# EAGLE design MicroSDBreakout-V1 (EAGLE 6.1)
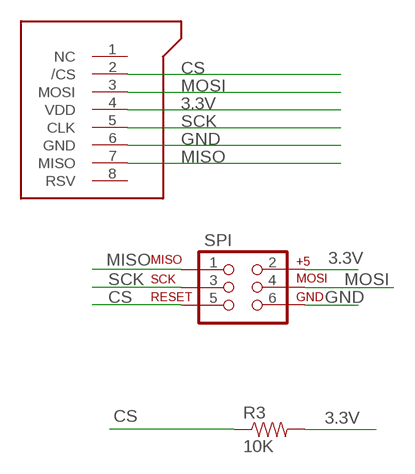
[diagram p0: schematic, sheet 1]

## Parts
R3  10K  RESISTOR0603-RES  [0603-RES]
SPI  AVR_SPI_PRG_6PTH  [2X3]
U$1  MICROSD  [MICRO-SD-SOCKET-PP]

## Nets
3.3V: R3.2 SPI.2 U$1.4(VDD)
CS: R3.1 SPI.5 U$1.2(/CS)
GND: SPI.6 U$1.6(GND)
MISO: SPI.1 U$1.7(MISO)
MOSI: SPI.4 U$1.3(MOSI)
SCK: SPI.3 U$1.5(CLK)
Unconnected: U$1.1(NC) U$1.8(RSV)

## Library data of the parts
R3 = SparkFun:RESISTOR: Resistor Basic schematic elements and footprints for 0603, 1206, and PTH resistors.
SPI = SparkFun:AVR_SPI_PRG_6: AVR ISP 6 Pin This is the reduced ISP connector for AVR programming. Common on Arduino. This footprint will take up less PCB space and can be used with a 10-pin to 6-pin adapter such as SKU: BOB-08508
U$1 = group10:MICROSD

## Board
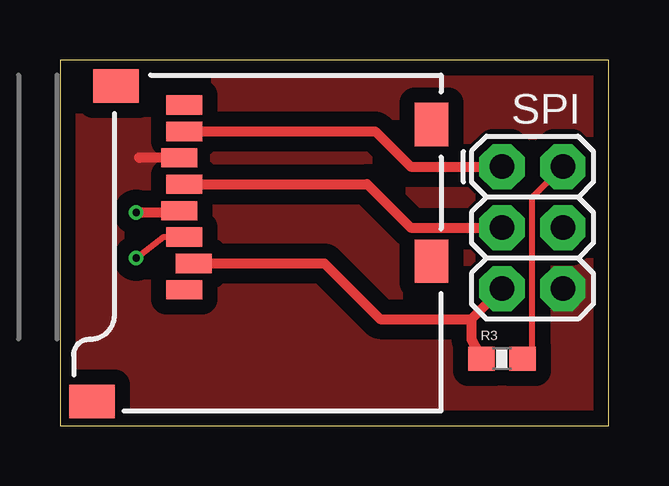
[diagram p1: board, top side]
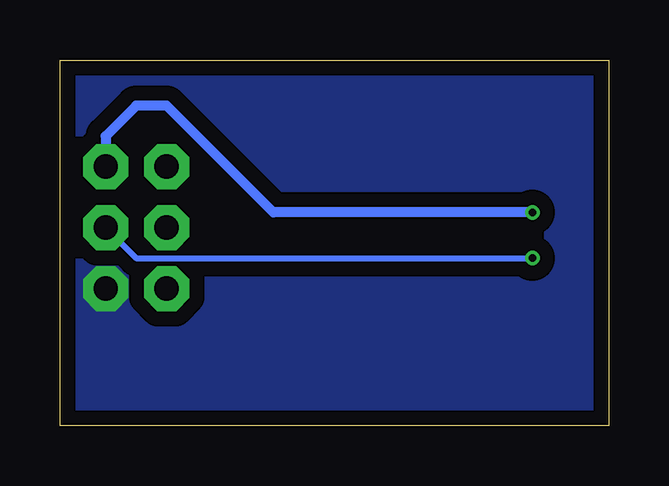
[diagram p2: board, bottom side, seen from below]

Size 22.86 x 15.24 mm. Coordinates in mm from the lower left corner, seen from the top.
Outline: 0,0 22.86,0 22.86,15.24 0,15.24 0,0
Copper layers (1*16): Top 0.035mm / dielectric 1.5mm / Bottom 0.035mm
Design rules: minimum track width 0.15mm, minimum drill 0.3mm, track to track 0.15mm, track to pad 0.15mm, pad to pad 0.15mm, via to via 0.15mm, smd to smd 0.15mm, copper to edge 0.3mm, drill to drill 0.2mm, minimum pad ring 0.2mm, minimum via ring 0.15mm, stop-mask expansion 0.075mm, vias tented up to drill 0mil, thermal gap 0.2mm

### Footprints (pad centres in the part's own frame; a part is rotated, then mirrored left to right if it is on the bottom)
0603-RES = smd 1.1 x 1: 1 -0.85,0; 2 0.85,0
2X3 = drill 1.016 pad 1.88 octagon: 1 0,0; 2 0,2.54; 3 2.54,0; 4 2.54,2.54; 5 5.08,0; 6 5.08,2.54
MICRO-SD-SOCKET-PP = smd 0.8 x 1.5: 1 -8.94,10.7; 2 -7.84,10.3; 3 -6.74,10.7; 4 -5.64,10.9; 5 -4.54,10.7; 6 -3.44,10.9; 7 -2.34,10.7; 8 -1.24,10.7 | smd 1.8 x 1.4: CD1 -2.05,0.4; CD2 -7.75,0.4 | smd 1.4 x 1.9: GND1 -13.6,14.55; GND3 -0.45,13.55

### Placement (x,y rotation side)
R3  18.41,2.79 0 top
SPI  18.41,10.79 270 top
U$1  15.88,14.61 90 top

### Tracks (layer width: path | path; a pad name or v marks a point on that pad's centre or on a via)
3.3V  (via drill 0.3)
  Top 0.254: R3.2 19.68,3.21 19.68,4.45 19.68,9.53 SPI.2
  Top 0.406: v3.17,8.89 5.05,8.89 U$1.4
  Bottom 0.406: v3.17,8.89 13.97,8.89 18.41,13.34 19.68,13.34 20.95,12.06 SPI.2
CS
  Top 0.406: U$1.2 11.02,6.76 13.34,4.45 17.14,4.45 | 17.14,4.45 SPI.5 | 17.14,4.45 17.14,3.6 R3.1
GND
  Top 0.406: U$1.6 3.31,11.16 3.3,11.18
  pour Bottom (isolate 0.635, no thermals): 0,15.24 22.86,15.24 22.86,0 0,0
  pour Top (isolate 0.635, no thermals): 0,15.24 22.86,15.24 22.86,0 0,0
MISO
  Top 0.406: U$1.7 13.13,12.27 14.61,10.79 SPI.1
MOSI  (via drill 0.3)
  Top 0.254: U$1.3 4.31,7.87 v3.17,6.99
  Bottom 0.254: SPI.4 19.68,6.99 3.43,6.99 v3.17,6.99
SCK
  Top 0.406: U$1.5 12.79,10.06 14.61,8.26 SPI.3